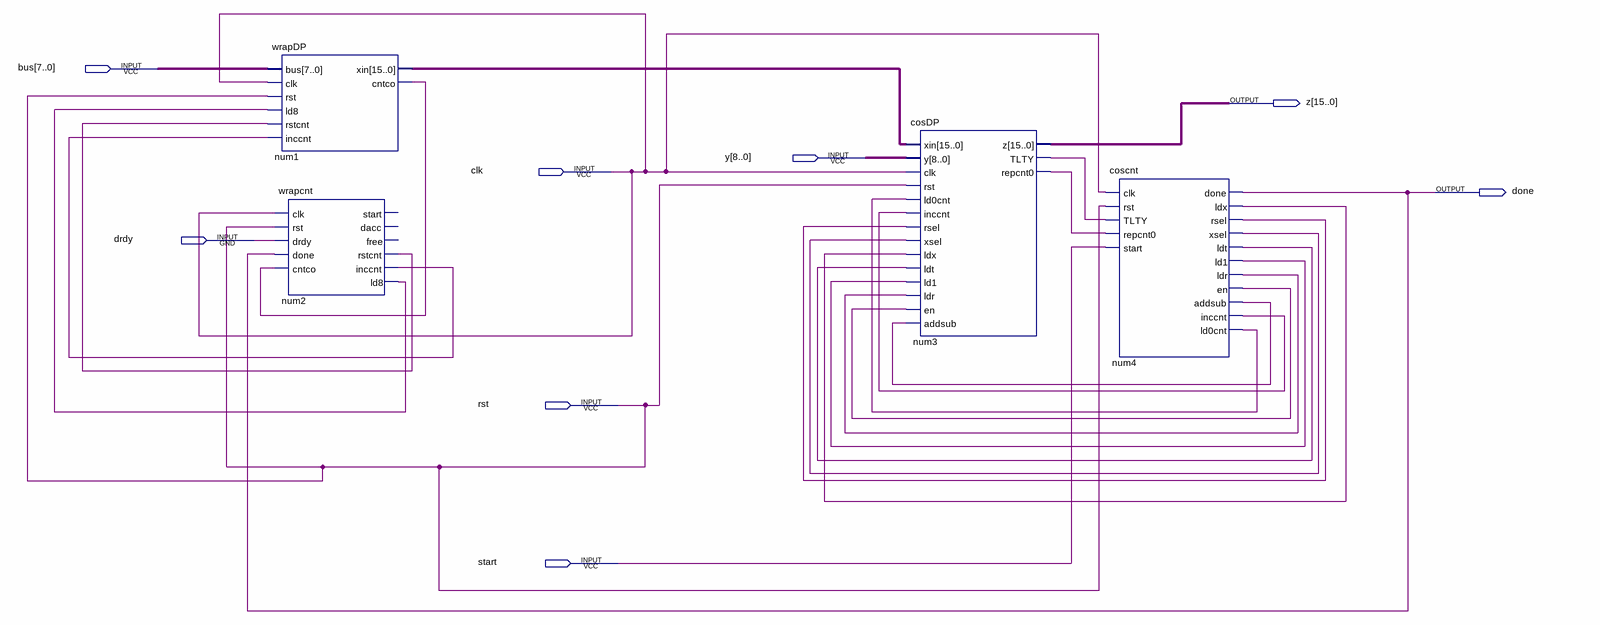
[diagram p0: schematic sheet]
// Quartus schematic blockwithbus.bdf as structural Verilog: 4 symbols, 8 pins
module blockwithbus (
  input  [7:0] bus,
  input  [8:0] y,
  input  clk,
  input  drdy,
  input  rst,
  input  start,
  output [15:0] z,
  output done
);

  wire num1_cntco, num2_inccnt, num2_ld8, num2_rstcnt, num3_repcnt0, num3_tlty, num4_addsub, num4_en,
       num4_inccnt, num4_ld0cnt, num4_ld1, num4_ldr, num4_ldt, num4_ldx, num4_rsel, num4_xsel;
  wire [15:0] num1_xin;

  wrapDP num1 (
    .bus(bus), .clk(clk), .rst(rst), .ld8(num2_ld8), .rstcnt(num2_rstcnt), .inccnt(num2_inccnt),
    .xin(num1_xin), .cntco(num1_cntco));
  wrapcnt num2 (
    .clk(clk), .rst(rst), .drdy(drdy), .done(done), .cntco(num1_cntco), .rstcnt(num2_rstcnt),
    .inccnt(num2_inccnt), .ld8(num2_ld8));  // open: start, dacc, free
  cosDP num3 (
    .xin(num1_xin), .y(y), .clk(clk), .rst(rst), .ld0cnt(num4_ld0cnt), .inccnt(num4_inccnt),
    .rsel(num4_rsel), .xsel(num4_xsel), .ldx(num4_ldx), .ldt(num4_ldt), .ld1(num4_ld1), .ldr(num4_ldr),
    .en(num4_en), .addsub(num4_addsub), .z(z), .TLTY(num3_tlty), .repcnt0(num3_repcnt0));
  coscnt num4 (
    .clk(clk), .rst(rst), .TLTY(num3_tlty), .repcnt0(num3_repcnt0), .start(start), .done(done),
    .ldx(num4_ldx), .rsel(num4_rsel), .xsel(num4_xsel), .ldt(num4_ldt), .ld1(num4_ld1), .ldr(num4_ldr),
    .en(num4_en), .addsub(num4_addsub), .inccnt(num4_inccnt), .ld0cnt(num4_ld0cnt));
endmodule
